# Altium schematic sheet FPGA4.SchDoc: FPGA-4
size A; Revision: 04
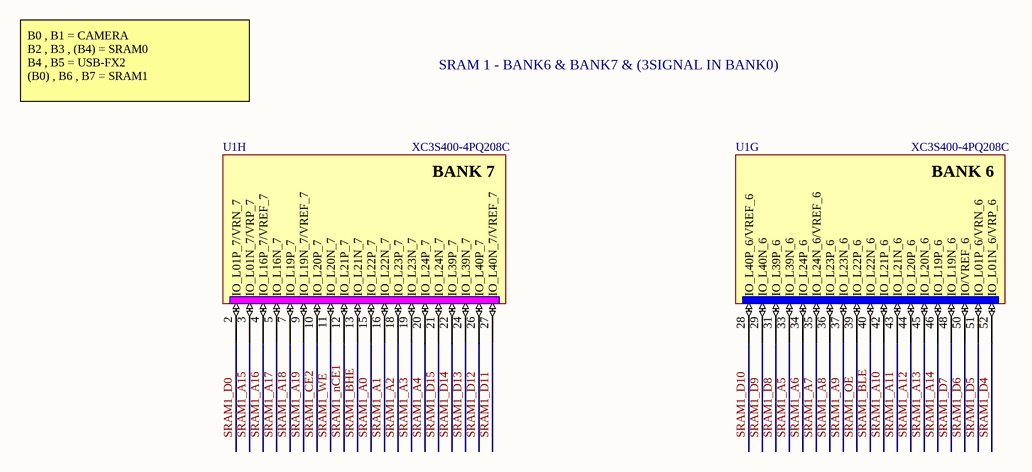
[diagram p0: FPGA4.SchDoc]

## Parts
U1  XC3S400-4PQ208C  [PQ208_N]  (parts G,H of 11)

## Nets
SRAM1_A0: U1.15(IO_L22P_7)
SRAM1_A1: U1.16(IO_L22N_7)
SRAM1_A2: U1.18(IO_L23P_7)
SRAM1_A3: U1.19(IO_L23N_7)
SRAM1_A4: U1.20(IO_L24P_7)
SRAM1_A5: U1.33(IO_L39N_6)
SRAM1_A6: U1.34(IO_L24P_6)
SRAM1_A7: U1.35(IO_L24N_6/VREF_6)
SRAM1_A8: U1.36(IO_L23P_6)
SRAM1_A9: U1.37(IO_L23N_6)
SRAM1_A10: U1.42(IO_L21P_6)
SRAM1_A11: U1.43(IO_L21N_6)
SRAM1_A12: U1.44(IO_L20P_6)
SRAM1_A13: U1.45(IO_L20N_6)
SRAM1_A14: U1.46(IO_L19P_6)
SRAM1_A15: U1.3(IO_L01N_7/VRP_7)
SRAM1_A16: U1.4(IO_L16P_7/VREF_7)
SRAM1_A17: U1.5(IO_L16N_7)
SRAM1_A18: U1.7(IO_L19P_7)
SRAM1_A19: U1.9(IO_L19N_7/VREF_7)
SRAM1_BHE: U1.13(IO_L21N_7)
SRAM1_BLE: U1.40(IO_L22N_6)
SRAM1_CE2: U1.10(IO_L20P_7)
SRAM1_D0: U1.2(IO_L01P_7/VRN_7)
SRAM1_D4: U1.52(IO_L01N_6/VRP_6)
SRAM1_D5: U1.51(IO_L01P_6/VRN_6)
SRAM1_D6: U1.50(IO/VREF_6)
SRAM1_D7: U1.48(IO_L19N_6)
SRAM1_D8: U1.31(IO_L39P_6)
SRAM1_D9: U1.29(IO_L40N_6)
SRAM1_D10: U1.28(IO_L40P_6/VREF_6)
SRAM1_D11: U1.27(IO_L40N_7/VREF_7)
SRAM1_D12: U1.26(IO_L40P_7)
SRAM1_D13: U1.24(IO_L39N_7)
SRAM1_D14: U1.22(IO_L39P_7)
SRAM1_D15: U1.21(IO_L24N_7)
SRAM1_nCE1: U1.12(IO_L21P_7)
SRAM1_OE: U1.39(IO_L22P_6)
SRAM1_WE: U1.11(IO_L20N_7)

## Notes on the sheet
- SRAM 1 - BANK6 & BANK7 & (3SIGNAL IN BANK0)
- B0 , B1 = CAMERA
  B2 , B3 , (B4) = SRAM0
  B4 , B5 = USB-FX2
  (B0) , B6 , B7 = SRAM1
- Engineer:
- Title:
- Saleh Jamali
- Revision:
- (in symbol XC3S400-4PQ208C, part G) BANK 6
- (in symbol XC3S400-4PQ208C, part H) BANK 7

## Library data of the parts
U1 = XC3S400-4PQ208C: Spartan-3 1.2V FPGA, 141 User I/Os, 208-Pin PQFP, Standard Performance, Commercial Grade; OrderingInformation: Additional code may have to be appended for different mask revision devices.; DatasheetVersion: ver2.5, Dec-2009; PackageVersion: ver1.2, Jun-2004; PackageReference: PQ208; PackageDescription: 208-Pin Plastic Quad Flat Pack (PQ208); Code_JEDEC: MS-029-FA-1; ComponentLink1Description: Manufacturer URL; ComponentLink1URL: http://www.xilinx.com/; ComponentLink2Description: Spartan-3 Datasheet; ComponentLink2URL: http://www.xilinx.com/support/documentation/data_sheets/ds099.pdf; ComponentLink3Description: PQ208 Package Drawing; ComponentLink3URL: http://www.xilinx.com/support/documentation/package_specs/pq208.pdf; ComponentLink4Description: Spartan-3 Documents; ComponentLink4URL: http://www.xilinx.com/support/documentation/spartan-3.htm